# Altium schematic sheet detection-circuit-ldc-hw.SchDoc
size A3; DrawnBy: Rogério J.M.; Revision: V1.0; SheetNumber: 2; SheetTotal: 2
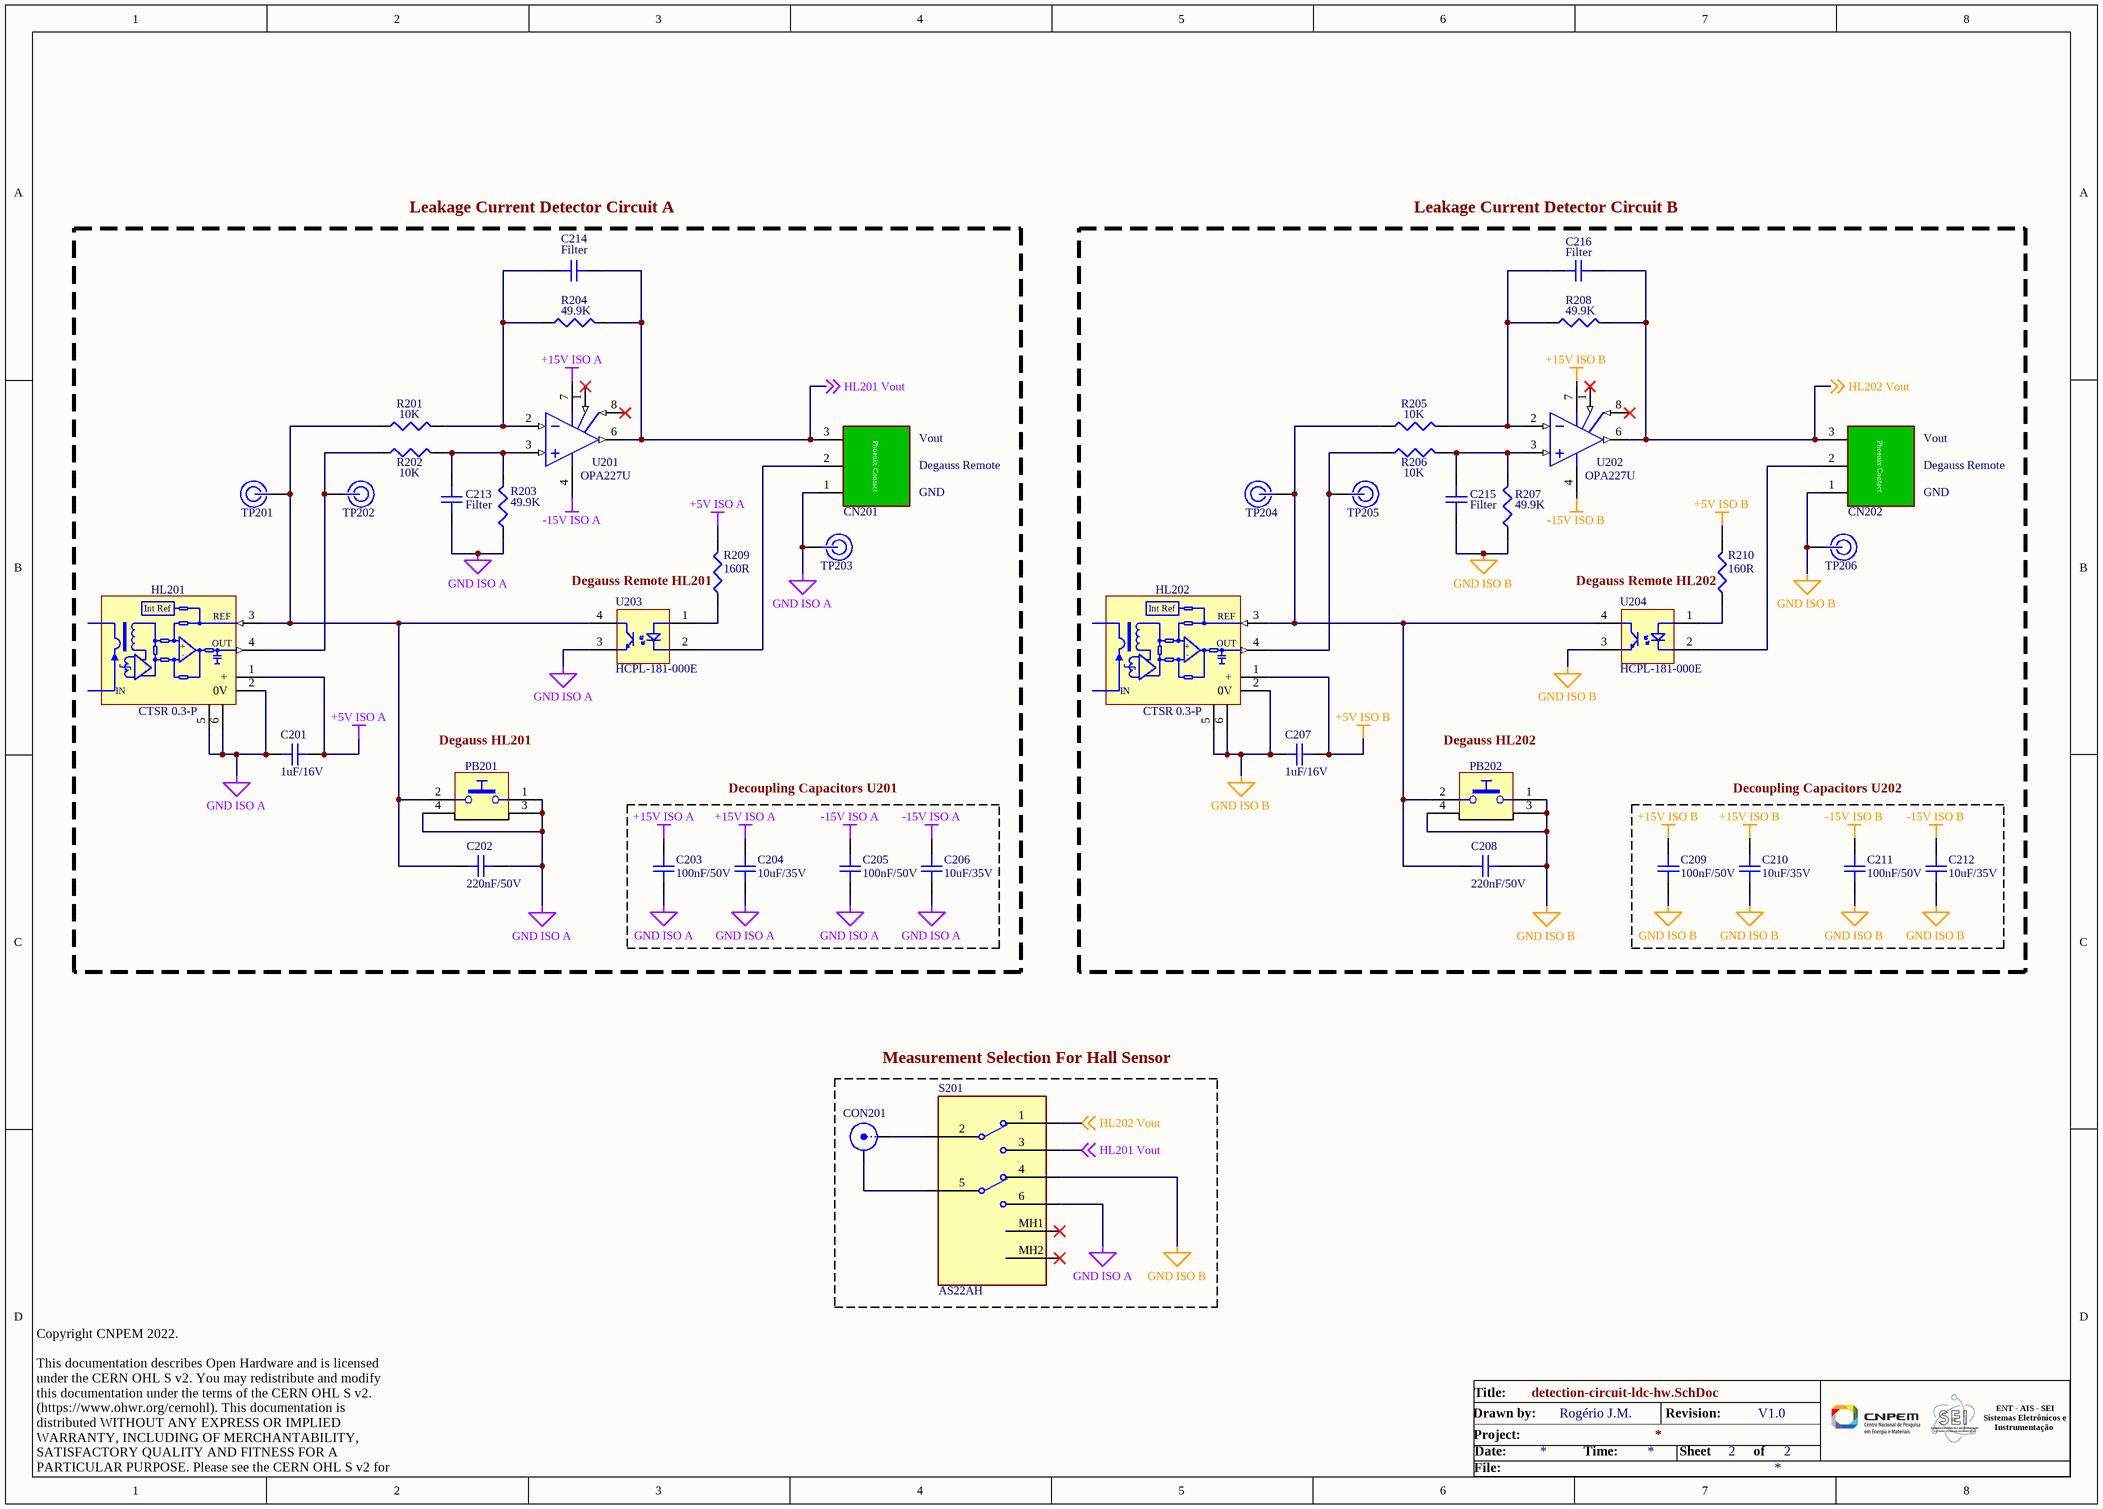
[diagram p0: detection-circuit-ldc-hw.SchDoc]

## Parts
C201  1uF/16V  [C0603]
C202  220nF/50V  [C0805]
C203  100nF/50V  [C0603]
C204  10uF/35V  [C0805]
C205  100nF/50V  [C0603]
C206  10uF/35V  [C0805]
C207  1uF/16V  [C0603]
C208  220nF/50V  [C0805]
C209  100nF/50V  [C0603]
C210  10uF/35V  [C0805]
C211  100nF/50V  [C0603]
C212  10uF/35V  [C0805]
C213  Filter  [C0805 - Filter]
C214  Filter  [C0805 - Filter]
C215  Filter  [C0805 - Filter]
C216  Filter  [C0805 - Filter]
CN201  1757255  [Conector Phoenix Contact 1757255]  (value not drawn)
CN202  1757255  [Conector Phoenix Contact 1757255]  (value not drawn)
CON201  BNC_Connector  [BNC_RIGHTANGLE]  (value not drawn)
HL201  CTSR 0.3-P  [LEM_CTSR 0.3-P]
HL202  CTSR 0.3-P  [LEM_CTSR 0.3-P]
PB201  SKHHLMA010  [PB_ALPS_SKHHLMA010]  (value not drawn)
PB202  SKHHLMA010  [PB_ALPS_SKHHLMA010]  (value not drawn)
R201  10K  [R0603]
R202  10K  [R0603]
R203  49.9K  [R0603]
R204  49.9K  [R0603]
R205  10K  [R0603]
R206  10K  [R0603]
R207  49.9K  [R0603]
R208  49.9K  [R0603]
R209  160R  [R0805]
R210  160R  [R0805]
S201  AS22AH  [AS22AH]
TP201  Test Point White 5012  [TEST POINT]  (value not drawn)
TP202  Test Point White 5012  [TEST POINT]  (value not drawn)
TP203  Test Point White 5012  [TEST POINT]  (value not drawn)
TP204  Test Point White 5012  [TEST POINT]  (value not drawn)
TP205  Test Point White 5012  [TEST POINT]  (value not drawn)
TP206  Test Point White 5012  [TEST POINT]  (value not drawn)
U201  OPA227U  [SOIC_8_N]
U202  OPA227U  [SOIC_8_N]
U203  HCPL-181-000E  [HCPL-181-000E]
U204  HCPL-181-000E  [HCPL-181-000E]

## Blocks framed on the sheet
Leakage Current Detector Circuit A: C201 C202 C213 C214 CN201 HL201 PB201 R201-R204 R209 TP201-TP203 U201 U203
Leakage Current Detector Circuit B: C207 C208 C215 C216 CN202 HL202 PB202 R205-R208 R210 TP204-TP206 U202 U204
Decoupling Capacitors U201: C203-C206
Decoupling Capacitors U202: C209-C212
Measurement Selection For Hall Sensor: CON201 S201

## Nets
+5V ISO A: C201.1 HL201.1(+) R209.2
+5V ISO B: C207.1 HL202.1(+) R210.2
+15V ISO A: C203.2 C204.2 U201.7(V+)
+15V ISO B: C209.2 C210.2 U202.7(V+)
-15V ISO A: C205.2 C206.2 U201.4(V-)
-15V ISO B: C211.2 C212.2 U202.4(V-)
GND ISO A: C201.2 C202.2 C203.1 C204.1 C205.1 C206.1 C213.1 CN201.1 HL201.2(0V) HL201.5 HL201.6 PB201.1 PB201.3 PB201.4 R203.1 S201.6(NO_2) TP203.1 U203.3(E)
GND ISO B: C207.2 C208.2 C209.1 C210.1 C211.1 C212.1 C215.1 CN202.1 HL202.2(0V) HL202.5 HL202.6 PB202.1 PB202.3 PB202.4 R207.1 S201.4(NC_2) TP206.1 U204.3(E)
HL201 Vout: C214.1 CN201.3 R204.2 S201.3(NO_1) U201.6(Output) ; off-sheet HL201 Vout
HL202 Vout: C216.1 CN202.3 R208.2 S201.1(NC_1) U202.6(Output) ; off-sheet HL202 Vout
NetC202_1: C202.1 HL201.3(REF) PB201.2 R201.1 TP201.1 U203.4(C)
NetC208_1: C208.1 HL202.3(REF) PB202.2 R205.1 TP204.1 U204.4(C)
NetC213_2: C213.2 R202.2 R203.2 U201.3(+In)
NetC214_2: C214.2 R201.2 R204.1 U201.2(-In)
NetC215_2: C215.2 R206.2 R207.2 U202.3(+In)
NetC216_2: C216.2 R205.2 R208.1 U202.2(-In)
NetCN201_2: CN201.2 U203.2(K)
NetCN202_2: CN202.2 U204.2(K)
NetCON201_1: CON201.1(X) S201.2(COM_1)
NetCON201_2: CON201.2(Y) S201.5(COM_2)
NetHL201_4: HL201.4(OUT) R202.1 TP202.1
NetHL202_4: HL202.4(OUT) R206.1 TP205.1
NetR209_1: R209.1 U203.1(A)
NetR210_1: R210.1 U204.1(A)

Not connected (* = marked no-connect by the designer): S201 MH1* MH2*; U201 1(Trim)* 5(NC) 8(Trim)*; U202 1(Trim)* 5(NC) 8(Trim)*

## Notes on the sheet
- Vout
- Degauss Remote
- GND
- (near R209) Degauss Remote HL201
- (near R210) Degauss Remote HL202
- (near PB201) Degauss HL201
- (near PB202) Degauss HL202
- Title:
- Date:
- Project:
- Drawn by:
- Time:
- Revision:
- Sheet
- of
- ENT - AIS - SEI
  Sistemas Eletrônicos e
  Instrumentação
- Copyright CNPEM 2022.
  This documentation describes Open Hardware and is licensed under the CERN OHL S v2. You may redistribute and modify this documentation under the terms of the CERN OHL S v2. (https://www.ohwr.org/cernohl). This documentation is distributed WITHOUT ANY EXPRESS OR IMPLIED WARRANTY, INCLUDING OF MERCHANTABILITY, SATISFACTORY QUALITY AND FITNESS FOR A PARTICULAR PURPOSE. Please see the CERN OHL S v2 for applicable conditions.
- File:
- (in symbol CTSR 0.3-P) Int Ref; -; IN

## Library data of the parts
C201 C207 = Capacitor 1uF/16V: CAP CER 1UF 16V X7R 0603; Manufacturer: TDK; Manufacturer Part Number: C1608X7R1C105K080AC; Dielectric Material: Ceramic; Tolerance: 10%; Código LNLS: AP105441; Supplier 1: Newark; RoHS: Yes; Category: Ceramic Capacitors; Stock 1: 68000; Pricing 1: 1=0,02900, 4000=0,02800, 8000=0,02600 (USD); Mount: Surface Mount; Case/Package: 0603; Case Code (Metric): 1608; Case Code (Imperial): 0603; Weight: 7.1E-05oz; Min Operating Temperature: -55°C; Max Operating Temperature: 125°C; Capacitance: 1uF; Dielectric: X7R; Voltage Rating: 16V; Packaging: Tape and Reel; Package Quantity: 1; Voltage Rating (DC): 16V; Termination: SMD/SMT; Voltage: 16V; Series: C; Construction: Flat; Resistor Type: Ceramic; Length: 1.6mm; Width: 0.031inch; Height: 0.8mm; Depth: 0.8mm; Thickness: 0.037inch; Radiation Hardening: No; REACH SVHC: No SVHC; Lead Free: Lead Free; RoHS Compliant: Yes; ComponentLink1URL: https://datasheet.ciiva.com/11788/0900766b80c1bb00-11788075.pdf?src-supplier=RSComponents; ComponentLink1Description: https://datasheet.ciiva.com/11788/0900766b80c1bb00-11788075.pdf?src-supplier=RSComponents; ComponentLink2URL: https://datasheet.ciiva.com/22648/1796654-22648704.pdf?src-supplier=Element14; ComponentLink2Description: https://datasheet.ciiva.com/22648/1796654-22648704.pdf?src-supplier=Element14; ComponentLink3URL: https://datasheet.ciiva.com/6156/1571323-6156168.pdf?src-supplier=Farnell; ComponentLink3Description: https://datasheet.ciiva.com/6156/1571323-6156168.pdf?src-supplier=Farnell; ComponentLink4URL: https://datasheet.ciiva.com/6250/tdkmlcccaprange-6250871.pdf?src-supplier=Digi-Key; ComponentLink4Description: https://datasheet.ciiva.com/6250/tdkmlcccaprange-6250871.pdf?src-supplier=Digi-Key; ComponentLink5URL: https://datasheet.ciiva.com/48671/e412-c-48671305.pdf?src-supplier=Avnet; ComponentLink5Description: https://datasheet.ciiva.com/48671/e412-c-48671305.pdf?src-supplier=Avnet; ComponentLink6URL: https://datasheet.ciiva.com/26285/3025c1608x7r1c105k080ac-26285242.pdf?src-supplier=Onlinecomponents.com; ComponentLink6Description: https://datasheet.ciiva.com/26285/3025c1608x7r1c105k080ac-26285242.pdf?src-supplier=Onlinecomponents.com; ComponentLink7URL: https://datasheet.ciiva.com/22694/1796654-22694127.pdf?src-supplier=Element14; ComponentLink7Description: https://datasheet.ciiva.com/22694/1796654-22694127.pdf?src-supplier=Element14; ComponentLink8URL: https://datasheet.ciiva.com/22749/1744655-22749595.pdf?src-supplier=Element14; ComponentLink8Description: https://datasheet.ciiva.com/22749/1744655-22749595.pdf?src-supplier=Element14; ComponentLink9URL: https://datasheet.ciiva.com/16199/e412-c-16199815.pdf?src-supplier=Future+Electronics; ComponentLink9Description: https://datasheet.ciiva.com/16199/e412-c-16199815.pdf?src-supplier=Future+Electronics; ComponentLink10URL: https://datasheet.ciiva.com/15192/getdatasheetpartid-715881-15192029.pdf?src-supplier=Verical; ComponentLink10Description: https://datasheet.ciiva.com/15192/getdatasheetpartid-715881-15192029.pdf?src-supplier=Verical; ComponentLink11URL: https://datasheet.ciiva.com/17487/e412-c-17487343.pdf?src-supplier=Avnet+Europe; ComponentLink11Description: https://datasheet.ciiva.com/17487/e412-c-17487343.pdf?src-supplier=Avnet+Europe; Supplier Part Number 1: 87R3669
C202 C208 = Capacitor 220nF/50V: CAP CER 220NF 50V X7R 0805; Manufacturer: Murata; Manufacturer Part Number: GRM21BR71H224MA01L; Tolerance: 20%; Código LNLS: AP112018; Supplier 1: Digi-Key; RoHS: Yes; Category: Ceramic Capacitors; Stock 1: 27774; Pricing 1: 1=0,37000, 10=0,25200, 50=0,16800, 100=0,14270, 500=0,10074, 1000=0,08815 (USD); Mount: Surface Mount; Case/Package: 0805; Case Code (Metric): 2012; Case Code (Imperial): 0805; Min Operating Temperature: -55°C; Max Operating Temperature: 125°C; Package Quantity: 1; Capacitance: 220nF; Packaging: Tape and Reel; Voltage Rating: 50V; Dielectric: X7R; Termination: SMD/SMT; Voltage Rating (DC): 50V; Series: GRM; Construction: Flat; Length: 2mm; Width: 0.049inch; Height: 1.25mm; Thickness: 0.053inch; Depth: 1.25mm; Radiation Hardening: No; Lead Free: Lead Free; RoHS Compliant: Yes; ComponentLink1URL: https://datasheet.ciiva.com/5421/product-5421097.pdf?src-supplier=Mouser; ComponentLink1Description: https://datasheet.ciiva.com/5421/product-5421097.pdf?src-supplier=Mouser; ComponentLink2URL: https://datasheet.ciiva.com/136/partnumbering-e-01-136537.pdf?src-supplier=Digi-Key; ComponentLink2Description: https://datasheet.ciiva.com/136/partnumbering-e-01-136537.pdf?src-supplier=Digi-Key; ComponentLink3URL: https://datasheet.ciiva.com/136/partnumbering-e-01-136536.pdf?src-supplier=Digi-Key; ComponentLink3Description: https://datasheet.ciiva.com/136/partnumbering-e-01-136536.pdf?src-supplier=Digi-Key; ComponentLink4URL: https://datasheet.ciiva.com/136/partnumbering-e-01-136538.pdf?src-supplier=Digi-Key; ComponentLink4Description: https://datasheet.ciiva.com/136/partnumbering-e-01-136538.pdf?src-supplier=Digi-Key; Supplier Part Number 1: 490-1671-1-ND
C203 C205 C209 C211 = Capacitor 100nF/50V: CAP CER 0.1UF 50V X7R 0603; Manufacturer: TDK; Manufacturer Part Number: C1608X7R1H104K080AA; Dielectric Material: Ceramic; Capacitance: 100nF; Tolerance: 10%; Código LNLS: AP107349; Supplier 1: Digi-Key; RoHS: Yes; Category: Ceramic Capacitors; Stock 1: 4478231; Pricing 1: 1=0,11000, 10=0,08000, 50=0,04520, 100=0,03750, 500=0,02630, 1000=0,02178 (USD); Mount: Surface Mount; Case/Package: 0603; Number of Pins: 2; Case Code (Imperial): 0603; Case Code (Metric): 1608; Weight: 7.1E-05oz; Min Operating Temperature: -55°C; Max Operating Temperature: 125°C; Dielectric: X7R; Voltage Rating: 50V; Packaging: Tape and Reel; Package Quantity: 1; Termination: SMD/SMT; Voltage: 50V; Construction: Flat; Voltage Rating (DC): 50V; Resistor Type: Ceramic; Series: C; Length: 1.6mm; Width: 0.031inch; Height: 0.8mm; Depth: 0.8mm; Thickness: 0.037inch; Radiation Hardening: No; REACH SVHC: No SVHC; RoHS Compliant: Yes; Lead Free: Lead Free; ComponentLink1URL: https://datasheet.ciiva.com/14498/1756137-14498091.pdf?src-supplier=Farnell; ComponentLink1Description: https://datasheet.ciiva.com/14498/1756137-14498091.pdf?src-supplier=Farnell; ComponentLink2URL: https://datasheet.ciiva.com/11788/0900766b80c1bb00-11788073.pdf?src-supplier=RSComponents; ComponentLink2Description: https://datasheet.ciiva.com/11788/0900766b80c1bb00-11788073.pdf?src-supplier=RSComponents; ComponentLink3URL: https://datasheet.ciiva.com/6293/tdkmlcccaprange-6293190.pdf?src-supplier=Digi-Key; ComponentLink3Description: https://datasheet.ciiva.com/6293/tdkmlcccaprange-6293190.pdf?src-supplier=Digi-Key; ComponentLink4URL: https://datasheet.ciiva.com/6293/tdkmlcccaprange-6293193.pdf?src-supplier=Digi-Key; ComponentLink4Description: https://datasheet.ciiva.com/6293/tdkmlcccaprange-6293193.pdf?src-supplier=Digi-Key; ComponentLink5URL: https://datasheet.ciiva.com/6293/tdkmlcccaprange-6293194.pdf?src-supplier=Digi-Key; ComponentLink5Description: https://datasheet.ciiva.com/6293/tdkmlcccaprange-6293194.pdf?src-supplier=Digi-Key; ComponentLink6URL: https://datasheet.ciiva.com/22749/1744655-22749597.pdf?src-supplier=Element14; ComponentLink6Description: https://datasheet.ciiva.com/22749/1744655-22749597.pdf?src-supplier=Element14; ComponentLink7URL: https://datasheet.ciiva.com/17487/e412-c-17487370.pdf?src-supplier=Avnet+Europe; ComponentLink7Description: https://datasheet.ciiva.com/17487/e412-c-17487370.pdf?src-supplier=Avnet+Europe; Supplier Part Number 1: 445-1314-1-ND
C204 C206 C210 C212 = Capacitor 10uF/35V: CAP CER 10UF 35V X5R 0805; Manufacturer: TDK; Manufacturer Part Number: C2012X5R1V106K085AC; Dielectric Material: Ceramic; Tolerance: 10%; Código LNLS: AP105062; Supplier 1: Digi-Key; Stock 1: 56135; Pricing 1: 1=0.73, 10=0.519, 100=0.3416, 500=0.253, 1000=0.2151 (USD); Case/Package: 0805; Weight: 0.000194oz; Case Code (Metric): 2012; Case Code (Imperial): 0805; Min Operating Temperature: -55°C; Max Operating Temperature: 85°C; Package Quantity: 1; Packaging: Tape and Reel; Capacitance: 10uF; Voltage Rating: 35V; Dielectric: X5R; Termination: SMD/SMT; Voltage Rating (DC): 35V; Length: 0.079inch; Height: 0.85mm; Width: 0.049inch; Thickness: 0.039inch; REACH SVHC: No SVHC; Lead Free: Lead Free; ComponentLink1URL: https://datasheet.ciiva.com/14894/tdkmlcccaprange-14894527.pdf; ComponentLink1Description: https://datasheet.ciiva.com/14894/tdkmlcccaprange-14894527.pdf; Supplier Part Number 1: 445-14417-1-ND
C213-C216 = Capacitor Filter: CAP CER 0805
CN201 CN202 = Conector Phoenix Contact 1757255: TERM BLOCK HDR 3POS 90DEG 5.08MM; Max Current Rating: 12A; Number of Poles: 3; Voltage Rating: 250V; Number of Levels: 1; Current: 15A; Voltage: 300V; Gender: Male; Voltage Rating (DC): 320V; Connector Type: Plug; Approvals: UL,CSA,VDE,EN; Código LNLS: MT112921; Supplier 1: Digi-Key; Manufacturer: Phoenix Contact; Manufacturer Part Number: 1757255; Stock 1: 11643; Pricing 1: 1=0.98, 10=0.943, 50=0.902, 100=0.8774, 250=0.82, 500=0.7544, 1000=0.697, 2500=0.6642, 5000=0.6232 (USD); Mount: Through Hole; Weight: 5.396916oz; Colour: Green,Grey; Contact Plating: Tin; Housing Colour: Green; Housing Material: Polybutylene; Contact Material: Tin; Number of Rows: 1; Current Rating: 12A; Package Quantity: 50; Packaging: Bulk; Number of Positions: 3; Termination: Solder; Number of Positions Per Level: 3; Number of Contacts: 3; Orientation: Right Angle; Length: 17.24mm; Height: 12.1mm; Pitch: 5.08mm; Depth: 12mm; Width: 17.16mm; REACH SVHC: No SVHC; Lead Free: Lead Free; Flammability Rating: UL94 V-0; ComponentLink1URL: https://datasheet.ciiva.com/15197/getdatasheetpartid-176351-15197329.pdf; ComponentLink1Description: https://datasheet.ciiva.com/15197/getdatasheetpartid-176351-15197329.pdf; ComponentLink2URL: https://datasheet.ciiva.com/16096/1757255-16096404.pdf; ComponentLink2Description: https://datasheet.ciiva.com/16096/1757255-16096404.pdf; ComponentLink3URL: https://datasheet.ciiva.com/7630/1697152-7630840.pdf; ComponentLink3Description: https://datasheet.ciiva.com/7630/1697152-7630840.pdf; ComponentLink4URL: https://datasheet.ciiva.com/795/1757255-795421.pdf; ComponentLink4Description: https://datasheet.ciiva.com/795/1757255-795421.pdf; ComponentLink5URL: https://datasheet.ciiva.com/29210/569707-da-01-en-grundgehaeuse-1757255-250-st-29210878.pdf; ComponentLink5Description: https://datasheet.ciiva.com/29210/569707-da-01-en-grundgehaeuse-1757255-250-st-29210878.pdf; Supplier Part Number 1: 277-1107-ND
CON201 = BNC_Connector: Connector BNC Female 0Hz To 2GHz 50 Ohm Solder Right Angle Through Hole Gold Tray; Manufacturer: Molex; Manufacturer Part Number: 0731375003; Body Material: ZINC ALLOY; Body Plating: Nickel; Dielectric Material: PP; Center Contact Plating: Tin; Frequency: 2Hz; Impedance: 50R; Connector Type: BNC,Receptacle; Operating Frequency: 0 to 2Hz; Código LNLS: AP107369; ComponentLink1Description: Datasheet; Supplier 1: Digi-Key; RoHS: Yes; Category: RF / Coaxial Connectors; Stock 1: 5198; Pricing 1: 1=2,54000, 10=2,16200, 80=1,78600, 945=1,41000, 2400=1,31600 (USD); Mount: Through Hole,Panel,Bulkhead; Contact Plating: Gold; Contact Material: Bronze; Insulation Material: Polyester; Housing Color: Black; Min Operating Temperature: -20°C; Max Operating Temperature: 70°C; Packaging: Bulk; Package Quantity: 384; Termination: Solder; Orientation: Right Angle; Series: 73137; Fastening Type: Bayonet; Length: 35.18mm; Depth: 14.76mm; ComponentLink2URL: https://datasheet.ciiva.com/7002/731375003-sd-7002562.pdf?src-supplier=Digi-Key; ComponentLink2Description: https://datasheet.ciiva.com/7002/731375003-sd-7002562.pdf?src-supplier=Digi-Key; Supplier Part Number 1: WM5514-ND
HL201 HL202 = CTSR 0.3-P: SENSOR CURRENT FLUX 300MA AC/DC; Manufacturer: LEM; Frequency: 3.5kHz; Operating Supply Voltage: 5.25V; Number of Channels: 1; Response Time: 50us; Max Supply Current: 21.6mA; Polarity: Bidirectional; Accuracy: 1.9%; Min Supply Voltage (DC): 4.75V; Linearity: 0.5%; Wire/Cable Diameter: 20.3mm; Overall Height: 44.6mm; Overall Depth: 17.9mm; Código LNLS: MC113908; Supplier 1: Digi-Key; Manufacturer Part Number: CTSR0.3-P; RoHS: Yes; Category: Current Sensors; Stock 1: 1441; Pricing 1: 1=38,39000, 5=36,64400, 10=33,15500, 25=30,53760, 50=27,04760, 100=26,17500 (USD); Mount: Through Hole,PCB; Case/Package: Module; Min Operating Temperature: -40°C; Max Operating Temperature: 105°C; Packaging: Bulk; Package Quantity: 25; Max Supply Voltage (DC): 5.25V; Current Sensing: 300mA; Series: CTSR; REACH SVHC: No SVHC; ComponentLink1URL: https://datasheet.ciiva.com/2812/ctsr20series-2812567.pdf?src-supplier=Digi-Key; ComponentLink1Description: https://datasheet.ciiva.com/2812/ctsr20series-2812567.pdf?src-supplier=Digi-Key; ComponentLink2URL: https://datasheet.ciiva.com/30482/0900766b81272e9d-30482890.pdf?src-supplier=RSComponents; ComponentLink2Description: https://datasheet.ciiva.com/30482/0900766b81272e9d-30482890.pdf?src-supplier=RSComponents; Supplier Part Number 1: 398-1112-ND
PB201 PB202 = PB SPST 1NO-2NO 34CASE: PCB Switch 12 VDC 50 mA, SKHHLMA010, Alps; Manufacturer: Alps Electric; Mechanical Life: 1000000Cycles; Operating Force: 0.98N; Throw Configuration: SPST; Contact Resistance: 100mR; Max Voltage Rating (DC): 12V; Contact Current Rating: 50mA; Illumination Type: Illuminated; Actuator Type: STEM; Actuator Length: 3.85mm; Código LNLS: MC115903; Author: CERN DEM JLC; Supplier 1: Mouser; Manufacturer Part Number: SKHHLMA010; RoHS: Yes; Category: Tactile Switches; Stock 1: 5892; Pricing 1: 1=0,77000, 10=0,77000, 50=0,73100, 100=0,70200, 500=0,65800, 1000=0,65800, 10000=0,65800 (USD); Mount: Through Hole; Color: Black; Min Operating Temperature: -20°C; Max Operating Temperature: 85°C; Termination: Solder; Packaging: Bulk; Insulation Resistance: 100MR; Current Rating: 50mA; Package Quantity: 1000; Voltage Rating (DC): 12V; Max Current Rating: 50mA; Electrical Life: 1000000Cycles; Orientation: Right Angle; Series: SKHH; Length: 7.5mm; Depth: 7.85mm; Radiation Hardening: No; REACH SVHC: Unknown; Lead Free: Lead Free; RoHS Compliant: Yes; ComponentLink1URL: https://datasheet.ciiva.com/25603/0900766b810d5f21-25603887.pdf?src-supplier=RSComponents; ComponentLink1Description: https://datasheet.ciiva.com/25603/0900766b810d5f21-25603887.pdf?src-supplier=RSComponents; ComponentLink2URL: https://datasheet.ciiva.com/14142/03564812-14142526.pdf?src-supplier=Distrelec; ComponentLink2Description: https://datasheet.ciiva.com/14142/03564812-14142526.pdf?src-supplier=Distrelec; Supplier Part Number 1: 688-SKHHLM
R201 R202 R205 R206 = Resistor 10K: RES SMD 10K OHM 0.1% 1/16W 0603; Manufacturer: Stackpole Electronics; Manufacturer Part Number: RNCS0603BKE10K0; Resistance: 10kR; Max Power Dissipation: 63mW; Temperature Coefficient: 25ppm/°C; Código LNLS: MC116138; Supplier 1: Digi-Key; RoHS: Yes; Category: Chip SMD Resistors; Stock 1: 5697; Pricing 1: 1=0,47000, 10=0,36200, 100=0,15220 (USD); Mount: Surface Mount; Case/Package: 0603; Case Code (Metric): 1608; Case Code (Imperial): 0603; Contact Plating: Tin,Matte; Min Operating Temperature: -55°C; Max Operating Temperature: 155°C; Tolerance: 0.1%; Packaging: Tape and Reel; Resistor Type: Thin Film; Number of Terminations: 2; Features: Moisture Resistant,Automotive AEC-Q200; Series: RNCS; Length: 0.061inch; Width: 0.031inch; Height: 0.022inch; Radiation Hardening: No; Lead Free: Lead Free; RoHS Compliant: Yes; ComponentLink1URL: https://datasheet.ciiva.com/2479/sei-rncs-rnch-2479443.pdf?src-supplier=Digi-Key; ComponentLink1Description: https://datasheet.ciiva.com/2479/sei-rncs-rnch-2479443.pdf?src-supplier=Digi-Key; Supplier Part Number 1: RNCS0603BKE10K0CT-ND; ComponentLink2URL: https://datasheet.ciiva.com/2479/sei-rncs-rnch-2479444.pdf?src-supplier=Digi-Key; ComponentLink2Description: https://datasheet.ciiva.com/2479/sei-rncs-rnch-2479444.pdf?src-supplier=Digi-Key
R203 R204 R207 R208 = Resistor 49.9K: RES SMD 49.9K OHM 0.1% 1/10W 0603; Manufacturer: Panasonic; Manufacturer Part Number: ERA-3AEB4992V; Resistance: 49.9kR; Power Rating: 100mW; Voltage Rating: 75V; Temperature Coefficient: 25ppm/°C; Código LNLS: MC116139; Supplier 1: Digi-Key; RoHS: Yes; Category: Chip SMD Resistors; Stock 1: 44513; Pricing 1: 1=0,32000, 10=0,27300, 100=0,10660, 1000=0,04460, 2500=0,04089 (USD); Case/Package: 0603; Case Code (Metric): 1608; Case Code (Imperial): 0603; Min Operating Temperature: -55°C; Max Operating Temperature: 155°C; Package Quantity: 1; Tolerance: 0.1%; Packaging: Tape and Reel; Resistor Type: Thin Film; Number of Terminations: 2; Termination: SMD/SMT; Max Power Dissipation: 100mW; Voltage Rating (DC): 75V; Features: Automotive AEC-Q200; Series: ERA-3A; Length: 1.6mm; Width: 0.8mm; Height: 0.45mm; Lead Free: Lead Free; RoHS Compliant: Yes; ComponentLink1URL: https://datasheet.ciiva.com/11812/0900766b80eb1d8c-11812018.pdf?src-supplier=RSComponents; ComponentLink1Description: https://datasheet.ciiva.com/11812/0900766b80eb1d8c-11812018.pdf?src-supplier=RSComponents; Supplier Part Number 1: P49.9KDBCT-ND; Mount: Surface Mount; Number of Pins: 2; Contact Plating: Tin; Technology: METAL FILM; Resistance Tolerance: 0.1%; Construction: Rectangular; Depth: 0.8mm; Radiation Hardening: No; REACH SVHC: No SVHC; Military Standard: Not; ComponentLink2URL: https://datasheet.ciiva.com/29183/451874-da-01-en-widerstand-0603-era-29183904.pdf?src-supplier=Conrad; ComponentLink2Description: https://datasheet.ciiva.com/29183/451874-da-01-en-widerstand-0603-era-29183904.pdf?src-supplier=Conrad; ComponentLink3URL: https://datasheet.ciiva.com/5998/485442-5998330.pdf?src-supplier=Farnell; ComponentLink3Description: https://datasheet.ciiva.com/5998/485442-5998330.pdf?src-supplier=Farnell; ComponentLink4URL: https://datasheet.ciiva.com/5998/485442-5998332.pdf?src-supplier=Farnell; ComponentLink4Description: https://datasheet.ciiva.com/5998/485442-5998332.pdf?src-supplier=Farnell; ComponentLink5URL: https://datasheet.ciiva.com/5998/485442-5998334.pdf?src-supplier=Farnell; ComponentLink5Description: https://datasheet.ciiva.com/5998/485442-5998334.pdf?src-supplier=Farnell; ComponentLink6URL: https://datasheet.ciiva.com/30157/54aoa0000ce26-30157031.pdf?src-supplier=Onlinecomponents.com; ComponentLink6Description: https://datasheet.ciiva.com/30157/54aoa0000ce26-30157031.pdf?src-supplier=Onlinecomponents.com; ComponentLink7URL: https://datasheet.ciiva.com/7861/485442-7861691.pdf?src-supplier=Element14; ComponentLink7Description: https://datasheet.ciiva.com/7861/485442-7861691.pdf?src-supplier=Element14; ComponentLink8URL: https://datasheet.ciiva.com/46422/485442-46422700.pdf?src-supplier=Element14; ComponentLink8Description: https://datasheet.ciiva.com/46422/485442-46422700.pdf?src-supplier=Element14
R209 R210 = Resistor 160R: RES SMD 160R OHM 5% 1/2W 0805; Manufacturer: Panasonic; Manufacturer Part Number: ERJ-P06J161V; Temperature Coefficient: 200ppm/°C; Power Rating: 500mW; Voltage Rating: 150V; Código LNLS: MC115899; Supplier 1: Digi-Key; RoHS: Yes; Category: Chip SMD Resistors; Stock 1: 24271; Pricing 1: 1=0,12000, 10=0,10800, 100=0,04140, 1000=0,01822, 2500=0,01573 (USD); Mount: Surface Mount; Case/Package: 0805; Contact Plating: Tin; Case Code (Imperial): 0805; Case Code (Metric): 2012; Min Operating Temperature: -55°C; Max Operating Temperature: 155°C; Resistance: 160R; Tolerance: 5%; Resistor Type: Thick Film; Package Quantity: 5000; Packaging: Tape and Reel; Number of Terminations: 2; Max Power Dissipation: 500mW; Voltage Rating (DC): 150V; Features: Automotive AEC-Q200; Series: ERJ; Length: 0.079inch; Width: 1.2mm; Height: 0.028inch; Radiation Hardening: No; Lead Free: Contains Lead; RoHS Compliant: Yes; ComponentLink1URL: http://www.mouser.com/ds/2/315/AOA0000CE4-64075.pdf?src-supplier=Mouser; ComponentLink1Description: http://www.mouser.com/ds/2/315/AOA0000CE4-64075.pdf?src-supplier=Mouser; ComponentLink2URL: http://www.onlinecomponents.com/datasheet/erj-p06j161v.aspx?p=44459141&src-supplier=Onlinecomponents.com; ComponentLink2Description: http://www.onlinecomponents.com/datasheet/erj-p06j161v.aspx?p=44459141&src-supplier=Onlinecomponents.com; ComponentLink3URL: http://industrial.panasonic.com/www-data/pdf/AOA0000/AOA0000CE4.pdf?src-supplier=Avnet; ComponentLink3Description: http://industrial.panasonic.com/www-data/pdf/AOA0000/AOA0000CE4.pdf?src-supplier=Avnet; ComponentLink4URL: http://industrial.panasonic.com/www-data/pdf/AOA0000/AOA0000CE4.pdf?src-supplier=Avnet+Europe; ComponentLink4Description: http://industrial.panasonic.com/www-data/pdf/AOA0000/AOA0000CE4.pdf?src-supplier=Avnet+Europe; ComponentLink5URL: https://industrial.panasonic.com/ww/system/files/data/download/catalog/id_fixed-resistors_e_1.pdf?src-supplier=Digi-Key; ComponentLink5Description: https://industrial.panasonic.com/ww/system/files/data/download/catalog/id_fixed-resistors_e_1.pdf?src-supplier=Digi-Key; ComponentLink6URL: https://industrial.panasonic.com/cdbs/www-data/pdf/RDO0000/AOA0000C331.pdf?src-supplier=Digi-Key; ComponentLink6Description: https://industrial.panasonic.com/cdbs/www-data/pdf/RDO0000/AOA0000C331.pdf?src-supplier=Digi-Key; Supplier Part Number 1: P160ADCT-ND
S201 = AS22AH: Switch Slide ON None ON DPDT; Manufacturer: NKK Switches; Actuator Material: Nylon,Glass,Polyamide,Glass fibre; Mechanical Life: 50000Cycles; Max Current Rating: 100mA; Voltage Rating (AC): 28V; Operating Force: 260gf; Contact Style: Non-Shorting; Switch Travel: 2.5mm; Switch Function: On-On; Actuator Type: Standard; Código LNLS: MC115904; Supplier 1: Digi-Key; Manufacturer Part Number: AS22AH; RoHS: Yes; Category: Slide Switches; Stock 1: 1475; Pricing 1: 1=6,09000, 10=5,55700, 25=5,05440, 100=4,36620, 300=3,96930, 500=3,67822, 1000=3,41360, 2400=3,27500 (USD); Mount: Through Hole; Contact Material: Bronze; Contact Plating: Gold; Min Operating Temperature: -30°C; Max Operating Temperature: 85°C; Throw Configuration: DPDT; Package Quantity: 1; Max Voltage Rating (AC): 28V; Max Voltage Rating (DC): 28V; Packaging: Tray; Termination: PC Pins; Voltage Rating (DC): 28V; Electrical Life: 50000Cycles; Switching Voltage: 28V; Series: AS; Length: 9.8mm; Depth: 15.2mm; Actuator Length: 2.5mm; Lead Free: Lead Free; RoHS Compliant: Yes; ComponentLink1URL: https://datasheet.ciiva.com/15184/getdatasheetpartid-450041-15184194.pdf?src-supplier=Verical; ComponentLink1Description: https://datasheet.ciiva.com/15184/getdatasheetpartid-450041-15184194.pdf?src-supplier=Verical; ComponentLink2URL: https://datasheet.ciiva.com/26326/702195-da-01-en-schiebes-dpdt-on-on-re-gew-anschl-b-26326751.pdf?src-supplier=Conrad; ComponentLink2Description: https://datasheet.ciiva.com/26326/702195-da-01-en-schiebes-dpdt-on-on-re-gew-anschl-b-26326751.pdf?src-supplier=Conrad; Supplier Part Number 1: 360-2128-ND
TP201-TP206 = TEST POINT 5012: Manufacturer: Keystone Electronics; Manufacturer Part Number: 5012; Plating: Silver; Material - Insulation: Nylon 46, UL 94V-0; Material - Body: Phosphor Bronze; Código LNLS: MT105229; Supplier 1: Digi-Key; RoHS: RoHS Compliant; Category: Test and Measurement; Stock 1: 132720; Pricing 1: 1=0.37, 10=0.316, 50=0.2298, 100=0.2209, 250=0.19832, 500=0.18932, 1000=0.1616, 2500=0.14424, 5000=0.13523 (USD); Packaging: Bulk; Part Status: Active; Type: PC Test Point, Multipurpose; Mounting Type: 0.063" (1.60mm) Hole Diameter; Color: White; Size / Dimension: 0.125" Dia x 0.320" L (3.18mm x 8.13mm); Height: -; ComponentLink1URL: http://www.keyelco.com/product-pdf.cfm?p=1321; ComponentLink1Description: http://www.keyelco.com/product-pdf.cfm?p=1321; Supplier Part Number 1: 36-5012-ND
U201 U202 = OPA227U: TEXAS INSTRUMENTS - OPA227U - OP AMP, PRECISION, SOIC8, 227; Slew Rate: 2.3V/µs; Input Offset Voltage (Vos): 75uV; Input Bias Current: 10nA; Gain Bandwidth Product: 8MHz; Number of Circuits: 1; Operating Supply Current: 3.7mA; Max Dual Supply Voltage: 18V; Voltage Gain: 160dB; Nominal Supply Current: 3.8mA; Min Dual Supply Voltage: 2.5V; Common Mode Rejection Ratio: 120dB; Output Current: 45mA; Power Supply Rejection Ratio (PSRR): 126.02dB; Dual Supply Voltage: 9V; Código LNLS: AP104167; Supplier 1: Mouser; Manufacturer: Texas Instruments; Manufacturer Part Number: OPA227U; RoHS: Yes; Category: Amplifiers - Op Amps, Buffer, Instrumentation; Stock 1: 34; Pricing 1: 1=7,63000, 10=6,89000, 25=6,57000, 50=6,57000, 100=5,70000, 1000=5,44000, 10000=5,44000 (USD); Case/Package: D; Number of Pins: 8; Contact Plating: Gold; Min Operating Temperature: -40°C; Max Operating Temperature: 85°C; Packaging: Rail/Tube; Package Quantity: 75; Bandwidth: 8MHz; Number of Channels: 1; Nominal Gain Bandwidth Product: 8MHz; Max I/O Voltage: 75uV; Output Current per Channel: 45mA; Unity Gain Bandwidth Product: 8MHz; Number of Elements: 1; Max Supply Voltage: 18V; Number of Amplifiers: 1; Length: 4.9mm; Width: 3.91mm; Height: 1.58mm; Radiation Hardening: No; Lead Free: Lead Free; RoHS Compliant: Yes; REACH SVHC: No SVHC; ComponentLink1URL: https://datasheet.ciiva.com/26853/opa227u-26853600.pdf?src-supplier=IIIC; ComponentLink1Description: https://datasheet.ciiva.com/26853/opa227u-26853600.pdf?src-supplier=IIIC; ComponentLink2URL: https://datasheet.ciiva.com/7738/1830992-7738349.pdf?src-supplier=Element14; ComponentLink2Description: https://datasheet.ciiva.com/7738/1830992-7738349.pdf?src-supplier=Element14; ComponentLink3URL: https://datasheet.ciiva.com/1800/opa227-1800390.pdf?src-supplier=Digi-Key; ComponentLink3Description: https://datasheet.ciiva.com/1800/opa227-1800390.pdf?src-supplier=Digi-Key; Supplier Part Number 1: 595-OPA227U
U203 U204 = HCPL-181-000E: OPTOISO 3.75KV TRANSISTOR 4SOIC; Manufacturer: Broadcom Avago; Number of Channels: 1; Rise Time: 18000ns; Forward Voltage: 1.4V; Forward Current: 50mA; Collector Emitter Voltage (VCEO): 80V; Max Power Dissipation: 170mW; Reverse Breakdown Voltage: 6V; Collector Emitter Saturation Voltage: 200mV; Current Transfer Ratio: 600%; Approvals: UL,CSA,VDE; Código LNLS: MT106530; Supplier 1: Digi-Key; Manufacturer Part Number: HCPL-181-000E; Stock 1: 71062; Pricing 1: 1=0.61, 10=0.472, 25=0.3932, 100=0.3388, 250=0.3025, 500=0.2602, 1000=0.2009 (USD); Mount: Surface Mount; Case/Package: SOIC; Number of Pins: 4; Min Operating Temperature: -55°C; Max Operating Temperature: 100°C; Packaging: Tape and Reel; Max Output Voltage: 80V; Output Current per Channel: 50mA; Isolation Voltage: 3.75kV; Package Quantity: 1; Reverse Voltage (DC): 6V; Max Collector Current: 50mA; Fall Time: 18000ns; Max Input Current: 50mA; Number of Elements: 1; Power Dissipation: 170mW; Radiation Hardening: No; REACH SVHC: No SVHC; ComponentLink1URL: https://datasheet.ciiva.com/14169/hcpl-181-eng-tds-14169346.pdf; ComponentLink1Description: https://datasheet.ciiva.com/14169/hcpl-181-eng-tds-14169346.pdf; ComponentLink2URL: https://datasheet.ciiva.com/11772/0900766b80db8748-11772388.pdf; ComponentLink2Description: https://datasheet.ciiva.com/11772/0900766b80db8748-11772388.pdf; ComponentLink3URL: https://datasheet.ciiva.com/27052/1549927-27052468.pdf; ComponentLink3Description: https://datasheet.ciiva.com/27052/1549927-27052468.pdf; ComponentLink4URL: https://datasheet.ciiva.com/8065/317140-8065622.pdf; ComponentLink4Description: https://datasheet.ciiva.com/8065/317140-8065622.pdf; ComponentLink5URL: https://datasheet.ciiva.com/15118/getdatasheetpartid-138956-15118774.pdf; ComponentLink5Description: https://datasheet.ciiva.com/15118/getdatasheetpartid-138956-15118774.pdf; ComponentLink6URL: https://datasheet.ciiva.com/8065/317140-8065623.pdf; ComponentLink6Description: https://datasheet.ciiva.com/8065/317140-8065623.pdf; ComponentLink7URL: https://datasheet.ciiva.com/29301/140247-da-01-en-fototransistor-optokoppler-hcpl-181-000e-29301539.pdf; ComponentLink7Description: https://datasheet.ciiva.com/29301/140247-da-01-en-fototransistor-optokoppler-hcpl-181-000e-29301539.pdf; Supplier Part Number 1: 516-1646-1-ND